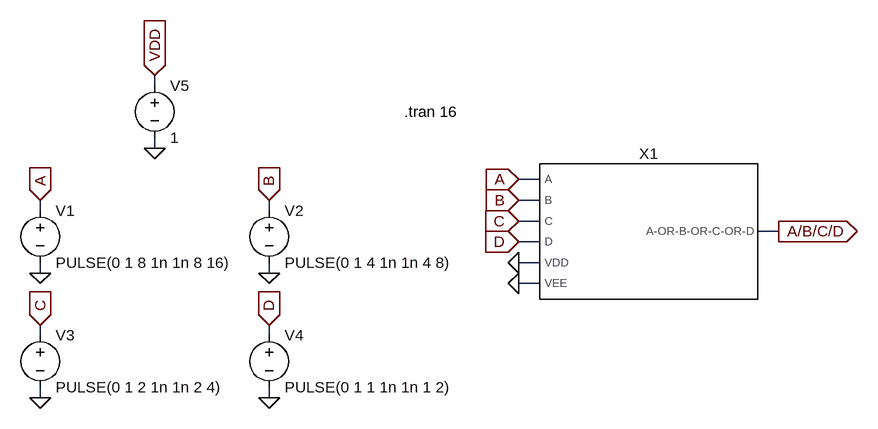
[diagram p0: schematic 4_Input_OR_Gate_Symbol_Test.asc]
4_Input_OR_Gate_Symbol_Test.asc, the LTspice schematic file:
Version 4
SHEET 1 1072 680
WIRE -32 -48 -32 -64
WIRE -32 48 -32 32
WIRE 560 96 528 96
WIRE 560 128 528 128
WIRE -208 144 -208 128
WIRE 144 144 144 128
WIRE 560 160 528 160
WIRE 928 176 896 176
WIRE 560 192 528 192
WIRE 560 224 528 224
WIRE -208 240 -208 224
WIRE 144 240 144 224
WIRE 560 256 528 256
WIRE -208 336 -208 320
WIRE 144 336 144 320
WIRE -208 432 -208 416
WIRE 144 432 144 416
FLAG 144 240 0
FLAG -208 240 0
FLAG -208 432 0
FLAG 144 432 0
FLAG -208 128 A
IOPIN -208 128 In
FLAG 144 128 B
IOPIN 144 128 In
FLAG -208 320 C
IOPIN -208 320 In
FLAG 144 320 D
IOPIN 144 320 In
FLAG -32 48 0
FLAG -32 -64 VDD
IOPIN -32 -64 In
FLAG 528 256 0
FLAG 528 96 A
IOPIN 528 96 In
FLAG 528 128 B
IOPIN 528 128 In
FLAG 528 160 C
IOPIN 528 160 In
FLAG 528 192 D
IOPIN 528 192 In
FLAG 928 176 A/B/C/D
IOPIN 928 176 Out
FLAG 528 224 0
SYMBOL 4_Input_OR_Gate_Symbol 720 176 R0
SYMATTR InstName X1
SYMBOL Voltage -208 128 R0
SYMATTR InstName V1
SYMATTR Value PULSE(0 1 8 1n 1n 8 16)
SYMBOL Voltage 144 128 R0
SYMATTR InstName V2
SYMATTR Value PULSE(0 1 4 1n 1n 4 8)
SYMBOL Voltage -208 320 R0
SYMATTR InstName V3
SYMATTR Value PULSE(0 1 2 1n 1n 2 4)
SYMBOL Voltage 144 320 R0
SYMATTR InstName V4
SYMATTR Value PULSE(0 1 1 1n 1n 1 2)
SYMBOL Voltage -32 -64 R0
SYMATTR InstName V5
SYMATTR Value 1
TEXT 352 -8 Left 2 !.tran 16

The netlist it stands for:
* 4_Input_OR_Gate_Symbol_Test.asc
XX1 A B C D 0 0 A/B/C/D 4_Input_OR_Gate_Symbol  ; pins A B C D VDD VEE A-OR-B-OR-C-OR-D
V1 A 0 PULSE(0 1 8 1n 1n 8 16)
V2 B 0 PULSE(0 1 4 1n 1n 4 8)
V3 C 0 PULSE(0 1 2 1n 1n 2 4)
V4 D 0 PULSE(0 1 1 1n 1n 1 2)
V5 VDD 0 1
.tran 16
.backanno
.end